# Altium schematic sheet User_Interface.SchDoc: User Interface
size A4; DocumentNumber: 14; SheetNumber: 14; SheetTotal: 51
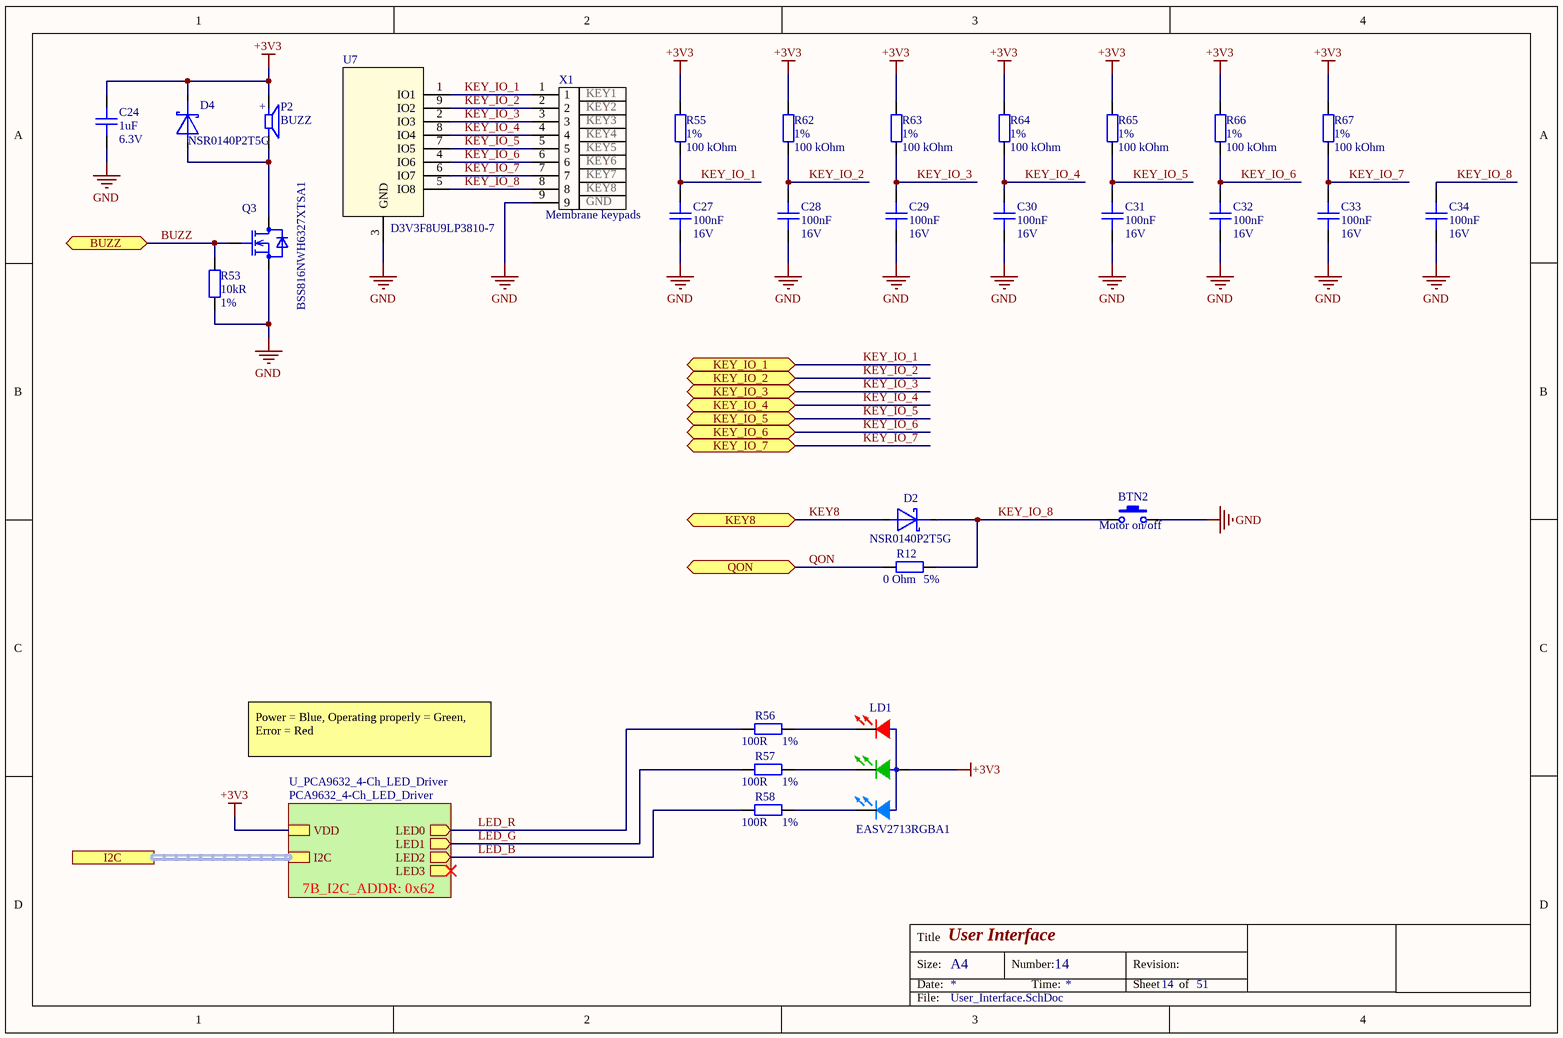
[diagram p0: User_Interface.SchDoc]

## Parts
BTN2  Motor on/off  [SWITCH KMS231GLFS]
C24  Capacitance: 1uF  Voltage Rating: 6.3V  [C0402]  (hidden comment: CAP CER 1UF 6.3V X5R 0402)
C27  Capacitance: 100nF  Voltage: 16V  [C0402]  (hidden comment: CAP CER 0.1UF 16V X7R 0402)
C28  Capacitance: 100nF  Voltage: 16V  [C0402]  (hidden comment: CAP CER 0.1UF 16V X7R 0402)
C29  Capacitance: 100nF  Voltage: 16V  [C0402]  (hidden comment: CAP CER 0.1UF 16V X7R 0402)
C30  Capacitance: 100nF  Voltage: 16V  [C0402]  (hidden comment: CAP CER 0.1UF 16V X7R 0402)
C31  Capacitance: 100nF  Voltage: 16V  [C0402]  (hidden comment: CAP CER 0.1UF 16V X7R 0402)
C32  Capacitance: 100nF  Voltage: 16V  [C0402]  (hidden comment: CAP CER 0.1UF 16V X7R 0402)
C33  Capacitance: 100nF  Voltage: 16V  [C0402]  (hidden comment: CAP CER 0.1UF 16V X7R 0402)
C34  Capacitance: 100nF  Voltage: 16V  [C0402]  (hidden comment: CAP CER 0.1UF 16V X7R 0402)
D2  NSR0140P2T5G  [SODFL100X40-2N]
D4  NSR0140P2T5G  [SODFL100X40-2N]
LD1  EASV2713RGBA1  [LED_EASV2713RGBA1]
P2  BUZZ  [SMT-0440-S-R_PUI]
Q3  BSS816NWH6327XTSA1  [SOT-323]
R12  Tolerance: 5%  Resistance: 0 Ohm  [R0402]  (hidden comment: RES SMD 0 OHM JUMPER 1/16W 0402)
R53  Resistance: 10kR  Tolerance: 1%  [R0402]  (hidden comment: RES SMD 10K OHM 1% 1/16W 0402)
R55  Tolerance: 1%  Resistance: 100 kOhm  [R0402]  (hidden comment: RES SMD 100K OHM 1% 1/16W 0402)
R56  Tolerance: 1%  Resistance: 100R  [R0402]  (hidden comment: RES SMD 100 OHM 1% 1/16W 0402)
R57  Tolerance: 1%  Resistance: 100R  [R0402]  (hidden comment: RES SMD 100 OHM 1% 1/16W 0402)
R58  Tolerance: 1%  Resistance: 100R  [R0402]  (hidden comment: RES SMD 100 OHM 1% 1/16W 0402)
R62  Tolerance: 1%  Resistance: 100 kOhm  [R0402]  (hidden comment: RES SMD 100K OHM 1% 1/16W 0402)
R63  Tolerance: 1%  Resistance: 100 kOhm  [R0402]  (hidden comment: RES SMD 100K OHM 1% 1/16W 0402)
R64  Tolerance: 1%  Resistance: 100 kOhm  [R0402]  (hidden comment: RES SMD 100K OHM 1% 1/16W 0402)
R65  Tolerance: 1%  Resistance: 100 kOhm  [R0402]  (hidden comment: RES SMD 100K OHM 1% 1/16W 0402)
R66  Tolerance: 1%  Resistance: 100 kOhm  [R0402]  (hidden comment: RES SMD 100K OHM 1% 1/16W 0402)
R67  Tolerance: 1%  Resistance: 100 kOhm  [R0402]  (hidden comment: RES SMD 100K OHM 1% 1/16W 0402)
U7  D3V3F8U9LP3810-7  [U-DFN3810-9]
X1  Membrane keypads  pin_1: KEY1  pin_2: KEY2  pin_3: KEY3  pin_4: KEY4  pin_5: KEY5  pin_6: KEY6  pin_7: KEY7  pin_8: KEY8  pin_9: GND  [CONN_0525590952]

## Sub-sheets
U_PCA9632_4-Ch_LED_Driver = PCA9632_4-Ch_LED_Driver: VDD, LED0 (out), LED1 (out), LED2 (out), LED3 (out), I2C (harness I2C)  | 7B_I2C_ADDR: 0x62

## Ports
BUZZ (bidir), I2C (harness I2C), KEY8 (bidir), KEY_IO_1 (bidir), KEY_IO_2 (bidir), KEY_IO_3 (bidir), KEY_IO_4 (bidir), KEY_IO_5 (bidir), KEY_IO_6 (bidir), KEY_IO_7 (bidir), QON (bidir)

## Nets
+3V3: C24.1 D4.1(K) LD1.1(A) P2.1 R55.2 R62.2 R63.2 R64.2 R65.2 R66.2 R67.2 ; sheet U_PCA9632_4-Ch_LED_Driver/VDD
GND: BTN2.2 C24.2 C27.2 C28.2 C29.2 C30.2 C31.2 C32.2 C33.2 C34.2 Q3.2(S) R53.2 U7.3(GND) X1.9
BUZZ: Q3.1(G) R53.1 ; port BUZZ
KEY8: D2.2(A) ; port KEY8
KEY_IO_1: C27.1 R55.1 U7.1(IO1) X1.1 ; port KEY_IO_1
KEY_IO_2: C28.1 R62.1 U7.9(IO2) X1.2 ; port KEY_IO_2
KEY_IO_3: C29.1 R63.1 U7.2(IO3) X1.3 ; port KEY_IO_3
KEY_IO_4: C30.1 R64.1 U7.8(IO4) X1.4 ; port KEY_IO_4
KEY_IO_5: C31.1 R65.1 U7.7(IO5) X1.5 ; port KEY_IO_5
KEY_IO_6: C32.1 R66.1 U7.4(IO6) X1.6 ; port KEY_IO_6
KEY_IO_7: C33.1 R67.1 U7.6(IO7) X1.7 ; port KEY_IO_7
KEY_IO_8: BTN2.1 C34.1 D2.1(K) R12.1 U7.5(IO8) X1.8
LED_B: R58.2 ; sheet U_PCA9632_4-Ch_LED_Driver/LED2
LED_G: R57.2 ; sheet U_PCA9632_4-Ch_LED_Driver/LED1
LED_R: R56.2 ; sheet U_PCA9632_4-Ch_LED_Driver/LED0
QON: R12.2 ; port QON
NetD4_2: D4.2(A) P2.2 Q3.3(D)
NetLD1_2: LD1.2(GK) R57.1
NetLD1_3: LD1.3(RK) R56.1
NetLD1_4: LD1.4(BK) R58.1

## Buses and harness runs
harness port I2C = sheet U_PCA9632_4-Ch_LED_Driver/I2C

## Notes on the sheet
- Power = Blue, Operating properly = Green,  Error = Red
- Title
- Size:
- Date:
- A4
- Number:
- Time:
- Revision:
- Sheet
- of
- File:
- (in symbol AUDIO MAGNETIC XDCR 2-4V SMD) +

## Library data of the parts
BTN2 = SWITCH TACTILE SPST-NO 0.05A 50V: Manufacturer: C&K; Manufacturer Part Number: KMS231GLFS; Mechanical Life: 100000Cycles; Throw Configuration: SPST; Actuator Type: Standard; Supplier 1: Digi-Key; Mount: Surface Mount; Min Operating Temperature: -40°C; Max Operating Temperature: 85°C; Packaging: Tape and Reel; Termination: SMD/SMT; ComponentLink1URL: https://www.digikey.com/en/products/detail/c-k/KMS231GLFS/499401; ComponentLink1Description: https://www.digikey.com/en/products/detail/c-k/KMS231GLFS/499401; Supplier Part Number 1: 401-1266-1-ND
C24 = CAP CER 1UF 6.3V X5R 0402: 1µF ±10% 6.3V Ceramic Capacitor X5R 0402 (1005 Metric); Manufacturer: Yageo; Manufacturer Part Number: CC0402KRX5R5BB105; Supplier 1: Digi-Key; Stock 1: 34926286; Pricing 1: 1=0.1, 10=0.05, 50=0.0272, 100=0.0222, 500=0.0158, 1000=0.0124, 2500=0.0113, 5000=0.0104 (USD); Mount: Surface Mount; Case/Package: 0402; Number of Pins: 2; Case Code (Metric): 1005; Case Code (Imperial): 0402; Min Operating Temperature: -55°C; Max Operating Temperature: 85°C; Packaging: Tape and Reel; Tolerance: 10%; Voltage Rating (DC): 6.3V; Dielectric: X5R; Termination: SMD/SMT; Package Quantity: 1; Composition: Ceramic; Length: 1mm; Height: 0.5mm; Width: 0.02inch; Thickness: 0.022inch; Depth: 0.5mm; Radiation Hardening: No; REACH SVHC: No SVHC; ComponentLink1URL: http://www.farnell.com/datasheets/70765.pdf?src-supplier=Farnell; ComponentLink1Description: http://www.farnell.com/datasheets/70765.pdf?src-supplier=Farnell; ComponentLink2URL: http://www.yageo.com/documents/recent/UPY-GPHC_X5R_4V-to-50V_25.pdf?src-supplier=Digi-Key; ComponentLink2Description: http://www.yageo.com/documents/recent/UPY-GPHC_X5R_4V-to-50V_25.pdf?src-supplier=Digi-Key; ComponentLink3URL: http://www.farnell.com/datasheets/2167237.pdf?src-supplier=Element14; ComponentLink3Description: http://www.farnell.com/datasheets/2167237.pdf?src-supplier=Element14; ComponentLink4URL: http://www.yageo.com/documents/recent/UPY-GPHC_X5R_4V-to-50V_12.pdf?src-supplier=Avnet+Europe; ComponentLink4Description: http://www.yageo.com/documents/recent/UPY-GPHC_X5R_4V-to-50V_12.pdf?src-supplier=Avnet+Europe; ComponentLink5URL: http://www.farnell.com/datasheets/1359354.pdf?src-supplier=Element14; ComponentLink5Description: http://www.farnell.com/datasheets/1359354.pdf?src-supplier=Element14; Supplier Part Number 1: 311-1438-1-ND; Dielectric Material: Ceramic; Lead Free: Lead Free; Halogen Free: Halogen Free; ComponentLink6URL: http://www.farnell.com/datasheets/70765.pdf?src-supplier=Element14; ComponentLink6Description: http://www.farnell.com/datasheets/70765.pdf?src-supplier=Element14; ComponentLink7URL: http://www.yageo.com/documents/recent/UPY-GPHC_X5R_4V-to-50V_12.pdf?src-supplier=Avnet; ComponentLink7Description: http://www.yageo.com/documents/recent/UPY-GPHC_X5R_4V-to-50V_12.pdf?src-supplier=Avnet
C27-C34 = CAP CER 0.1UF 16V X7R 0402: 0.1µF ±10% 16V Ceramic Capacitor X7R 0402 (1005 Metric); Manufacturer Part Number: CC0402KRX7R7BB104; Manufacturer: Yageo; Revision: July-2002: Re-released for DXP Platform.; Order: CC0402KRX7R7BB104; Supplier 1: Digi-Key; Stock 1: 25916830; Pricing 1: 1=0.1, 10=0.031, 100=0.0136, 500=0.0097, 1000=0.0077, 2500=0.007, 5000=0.0064 (USD); Mount: Surface Mount; Number of Pins: 2; Case Code (Metric): 1005; Case Code (Imperial): 0402; Min Operating Temperature: -55°C; Max Operating Temperature: 125°C; Tolerance: 10%; Dielectric: X7R; Voltage Rating: 16V; Voltage Rating (DC): 16V; Packaging: Tape and Reel; Package Quantity: 1; Termination: SMD/SMT; Composition: Ceramic; Length: 1mm; Height: 0.5mm; Width: 0.02inch; Thickness: 0.022inch; Depth: 0.5mm; Radiation Hardening: No; REACH SVHC: No SVHC; Lead Free: Lead Free; Halogen Free: Halogen Free; ComponentLink1URL: http://www.yageo.com/documents/recent/UPY-GPHC_X7R_6.3V-to-50V_8.pdf?src-supplier=Avnet+Europe; ComponentLink1Description: http://www.yageo.com/documents/recent/UPY-GPHC_X7R_6.3V-to-50V_8.pdf?src-supplier=Avnet+Europe; ComponentLink2URL: http://www.yageo.com/documents/recent/UPY-GPHC_X7R_6.3V-to-50V_18.pdf?src-supplier=Digi-Key; ComponentLink2Description: http://www.yageo.com/documents/recent/UPY-GPHC_X7R_6.3V-to-50V_18.pdf?src-supplier=Digi-Key; ComponentLink3URL: http://www.yageo.com/documents/recent/UPY-GPHC_X7R_6.3V-to-50V_8.pdf?src-supplier=Avnet; ComponentLink3Description: http://www.yageo.com/documents/recent/UPY-GPHC_X7R_6.3V-to-50V_8.pdf?src-supplier=Avnet; ComponentLink4URL: http://www.yageo.com/documents/recent/UPY-GPHC_X7R_6.3V-to-50V_18.pdf?src-supplier=Mouser; ComponentLink4Description: http://www.yageo.com/documents/recent/UPY-GPHC_X7R_6.3V-to-50V_18.pdf?src-supplier=Mouser; ComponentLink5URL: http://www.farnell.com/datasheets/2167236.pdf?src-supplier=Element14; ComponentLink5Description: http://www.farnell.com/datasheets/2167236.pdf?src-supplier=Element14; ComponentLink6URL: http://www.farnell.com/datasheets/1489800.pdf?src-supplier=Element14; ComponentLink6Description: http://www.farnell.com/datasheets/1489800.pdf?src-supplier=Element14; Supplier Part Number 1: 311-1338-1-ND
D2 = DIODE SCHOTTKY 30V 70MA SOD923: Diode Schottky 30V 70mA (DC) Surface Mount SOD-923; Manufacturer: ON Semiconductor; Forward Voltage: 350mV; Max Surge Current: 500mA; Max Power Dissipation: 100mW; Max Reverse Leakage Current: 500nA; Element Configuration: Single; Supplier 1: Digi-Key; Manufacturer Part Number: NSR0140P2T5G; Stock 1: 28802; Pricing 1: 1=0.36, 10=0.27, 25=0.2368, 100=0.1284, 500=0.1048, 1000=0.0777, 2500=0.0683 (USD); Case/Package: SOD-923-2; Number of Pins: 2; Contact Plating: Tin,Matte; Min Operating Temperature: -55°C; Max Operating Temperature: 125°C; Forward Current: 70mA; Package Quantity: 1; Packaging: Tape and Reel; Average Rectified Current: 70mA; Max Repetitive Reverse Voltage (Vrrm): 30V; Peak Reverse Current: 500nA; Power Dissipation: 100mW; Peak Non-Repetitive Surge Current: 500mA; Max Forward Surge Current (Ifsm): 500mA; Termination: SMD/SMT; Max Reverse Voltage (DC): 30V; Length: 0.85mm; Height: 0.43mm; Width: 0.65mm; Radiation Hardening: No; REACH SVHC: No SVHC; Lead Free: Lead Free; ComponentLink1URL: http://www.onsemi.com/pub_link/Collateral/NSR0140P2-D.PDF?src-supplier=Future+Electronics; ComponentLink1Description: http://www.onsemi.com/pub_link/Collateral/NSR0140P2-D.PDF?src-supplier=Future+Electronics; ComponentLink2URL: http://www.farnell.com/datasheets/2353885.pdf?src-supplier=Newark; ComponentLink2Description: http://www.farnell.com/datasheets/2353885.pdf?src-supplier=Newark; ComponentLink3URL: http://www.farnell.com/datasheets/86281.pdf?src-supplier=Element14; ComponentLink3Description: http://www.farnell.com/datasheets/86281.pdf?src-supplier=Element14; ComponentLink4URL: http://www.onsemi.com/pub/Collateral/NSR0140P2-D.PDF?src-supplier=Avnet; ComponentLink4Description: http://www.onsemi.com/pub/Collateral/NSR0140P2-D.PDF?src-supplier=Avnet; ComponentLink5URL: http://www.onsemi.com/pub/Collateral/NSR0140P2-D.PDF?src-supplier=Digi-Key; ComponentLink5Description: http://www.onsemi.com/pub/Collateral/NSR0140P2-D.PDF?src-supplier=Digi-Key; ComponentLink6URL: http://www.mouser.com/ds/2/308/NSR0140P2-D-115172.pdf?src-supplier=Mouser; ComponentLink6Description: http://www.mouser.com/ds/2/308/NSR0140P2-D-115172.pdf?src-supplier=Mouser; Supplier Part Number 1: NSR0140P2T5GOSCT-ND; Mount: Surface Mount
D4 = DIODE SCHOTTKY 30V 70MA SOD923: Diode Schottky 30V 70mA (DC) Surface Mount SOD-923; Manufacturer: ON Semiconductor; Forward Voltage: 350mV; Max Surge Current: 500mA; Peak Reverse Current: 500nA; Element Configuration: Single; Max Power Dissipation: 100mW; Supplier 1: Digi-Key; Manufacturer Part Number: NSR0140P2T5G; Stock 1: 28802; Pricing 1: 1=0.36, 10=0.27, 25=0.2368, 100=0.1284, 500=0.1048, 1000=0.0777, 2500=0.0683 (USD); Min Operating Temperature: -55°C; Max Operating Temperature: 125°C; Packaging: Tape and Reel; Radiation Hardening: No; Lead Free: Lead Free; ComponentLink1URL: http://www.onsemi.com/pub_link/Collateral/NSR0140P2-D.PDF?src-supplier=Future+Electronics; ComponentLink1Description: http://www.onsemi.com/pub_link/Collateral/NSR0140P2-D.PDF?src-supplier=Future+Electronics; ComponentLink2URL: http://www.farnell.com/datasheets/2353885.pdf?src-supplier=Newark; ComponentLink2Description: http://www.farnell.com/datasheets/2353885.pdf?src-supplier=Newark; ComponentLink3URL: http://www.farnell.com/datasheets/86281.pdf?src-supplier=Element14; ComponentLink3Description: http://www.farnell.com/datasheets/86281.pdf?src-supplier=Element14; Supplier Part Number 1: NSR0140P2T5GOSCT-ND; Number of Pins: 2; Forward Current: 70mA; Package Quantity: 1; Average Rectified Current: 70mA; Max Repetitive Reverse Voltage (Vrrm): 30V; Peak Non-Repetitive Surge Current: 500mA; Max Reverse Voltage (DC): 30V; Max Reverse Leakage Current: 500nA; Case/Package: SOD-923-2; Contact Plating: Tin,Matte; Power Dissipation: 100mW; Max Forward Surge Current (Ifsm): 500mA; Termination: SMD/SMT; Length: 0.85mm; Height: 0.43mm; Width: 0.65mm; REACH SVHC: No SVHC; ComponentLink4URL: http://www.onsemi.com/pub/Collateral/NSR0140P2-D.PDF?src-supplier=Avnet; ComponentLink4Description: http://www.onsemi.com/pub/Collateral/NSR0140P2-D.PDF?src-supplier=Avnet; ComponentLink5URL: http://www.onsemi.com/pub/Collateral/NSR0140P2-D.PDF?src-supplier=Digi-Key; ComponentLink5Description: http://www.onsemi.com/pub/Collateral/NSR0140P2-D.PDF?src-supplier=Digi-Key; ComponentLink6URL: http://www.mouser.com/ds/2/308/NSR0140P2-D-115172.pdf?src-supplier=Mouser; ComponentLink6Description: http://www.mouser.com/ds/2/308/NSR0140P2-D-115172.pdf?src-supplier=Mouser; Mount: Surface Mount
LD1 = LED RGB PCB SIDE VIEW SMD: Red, Green, Blue (RGB) 619nm Red, 532nm Green, 473nm Blue LED Indication - Discrete 1.85V Red, 2.9V Green, 2.9V Blue 4-SMD, No Lead; Manufacturer: Everlight Electronics Co Ltd; Color: Blue,Green,Red; Lens Style: Rectangle with Flat Top; Element Configuration: Common Anode; Lens Transparency: Diffused; Forward Voltage: 3.3V; Test Current: 5mA; Viewing Angle: 130°; Supplier 1: Digi-Key; Manufacturer Part Number: EASV2713RGBA1; Stock 1: 7810; Pricing 1: 1=0.51, 50=0.415, 100=0.298, 500=0.272 (USD); Mount: Surface Mount; Packaging: Tape and Reel; Height: 0.5mm; ComponentLink1URL: https://www.digikey.com/en/products/detail/everlight-electronics-co-ltd/EASV2713RGBA1/11200807; ComponentLink1Description: https://www.digikey.com/en/products/detail/everlight-electronics-co-ltd/EASV2713RGBA1/11200807; Supplier Part Number 1: 1080-EASV2713RGBA1TR-ND
P2 = AUDIO MAGNETIC XDCR 2-4V SMD: Buzzers Transducer, Externally Driven 90mA 4kHz 70dB @ 3V, 10cm Surface Mount Solder Pads; Manufacturer: Projects Unlimited; Manufacturer Part Number: SMT-0440-S-R; Supplier 1: Digi-Key; Stock 1: 4568; Pricing 1: 1=3.25, 10=2.689, 25=2.4812, 50=2.3302, 100=2.185, 500=1.885 (USD); Mount: Surface Mount; Min Operating Temperature: -20°C; Max Operating Temperature: 70°C; Termination: Solder; Frequency: 4kHz; Packaging: Tape and Reel; Voltage Rating: 3V; ComponentLink1URL: http://www.puiaudio.com/pdf/SMT-0440-S-R.pdf?src-supplier=Avnet; ComponentLink1Description: http://www.puiaudio.com/pdf/SMT-0440-S-R.pdf?src-supplier=Avnet; ComponentLink2URL: http://www.mouser.com/ds/2/334/SMT-0440-S-R-535654.pdf?src-supplier=Mouser; ComponentLink2Description: http://www.mouser.com/ds/2/334/SMT-0440-S-R-535654.pdf?src-supplier=Mouser; ComponentLink3URL: http://www.puiaudio.com/pdf/SMT-0440-S-R.pdf?src-supplier=Digi-Key; ComponentLink3Description: http://www.puiaudio.com/pdf/SMT-0440-S-R.pdf?src-supplier=Digi-Key; Supplier Part Number 1: 668-1488-1-ND; Operating Supply Current: 90mA; Sensing Method: Magnetic; Length: 4mm; Width: 4mm
Q3 = MOSFET BSS816NWH6327XTSA1 N-CH 20V 1.4A SOT323: N-Channel 20V 1.4A (Ta) 500mW (Ta) Surface Mount PG-SOT323-3; Manufacturer: Infineon; Rds On Max: 160mR; Rise Time: 9ns; Input Capacitance: 180pF; Turn-On Delay Time: 5.3ns; Turn-Off Delay Time: 11ns; Fall Time: 2.2ns; Threshold Voltage: 550mV; Gate to Source Voltage (Vgs): 8V; Number of Channels: 1; Supplier 1: Digi-Key; Manufacturer Part Number: BSS816NWH6327XTSA1; Stock 1: 12407; Pricing 1: 1=0.37, 10=0.306, 25=0.2564, 100=0.1254, 250=0.1234, 500=0.1046, 1000=0.0727 (USD); Mount: Surface Mount; Case/Package: SOT-323; Number of Pins: 3; Weight: 0.004395oz; Contact Plating: Tin; Min Operating Temperature: -55°C; Max Operating Temperature: 150°C; Packaging: Tape and Reel; Drain to Source Voltage (Vdss): 20V; Max Dual Supply Voltage: 20V; Continuous Drain Current (ID): 1.4A; Max Power Dissipation: 500mW; Drain to Source Breakdown Voltage: 20V; Drain to Source Resistance: 160mR; Package Quantity: 3000; Halogen Free: Halogen Free; REACH SVHC: No SVHC; Lead Free: Lead Free; ComponentLink1URL: http://www.infineon.com/dgdl/BSS816NW_Rev2.3_.pdf?folderId=db3a3043156fd573011622e10b5c1f67&fileId=db3a304335113a6301351e704a2e1332&src-supplier=Avnet; ComponentLink1Description: http://www.infineon.com/dgdl/BSS816NW_Rev2.3_.pdf?folderId=db3a3043156fd573011622e10b5c1f67&fileId=db3a304335113a6301351e704a2e1332&src-supplier=Avnet; ComponentLink2URL: http://www.farnell.com/datasheets/2117725.pdf?src-supplier=Farnell; ComponentLink2Description: http://www.farnell.com/datasheets/2117725.pdf?src-supplier=Farnell; ComponentLink3URL: https://www.infineon.com/dgdl/Infineon-BSS816NW-DS-v02_03-en.pdf?fileId=db3a304335113a6301351e704a2e1332&src-supplier=Digi-Key; ComponentLink3Description: https://www.infineon.com/dgdl/Infineon-BSS816NW-DS-v02_03-en.pdf?fileId=db3a304335113a6301351e704a2e1332&src-supplier=Digi-Key; ComponentLink4URL: http://components.arrow.com/part/dataview/53682469S9650N2051?src-supplier=Arrow; ComponentLink4Description: http://components.arrow.com/part/dataview/53682469S9650N2051?src-supplier=Arrow; ComponentLink5URL: http://www.farnell.com/datasheets/2117725.pdf?src-supplier=Element14; ComponentLink5Description: http://www.farnell.com/datasheets/2117725.pdf?src-supplier=Element14; ComponentLink6URL: http://www.mouser.com/ds/2/196/Infineon-BSS816NW-DS-v02_03-en-522793.pdf?src-supplier=Mouser; ComponentLink6Description: http://www.mouser.com/ds/2/196/Infineon-BSS816NW-DS-v02_03-en-522793.pdf?src-supplier=Mouser; Supplier Part Number 1: BSS816NWH6327XTSA1CT-ND
R12 = RES SMD 0 OHM JUMPER 1/16W 0402: 0 Ohms Jumper 0.063W, 1/16W Chip Resistor 0402 (1005 Metric) Moisture Resistant Thick Film; Manufacturer: Yageo; Manufacturer Part Number: RC0402JR-070RL; Power Rating: 62.5mW; Voltage Rating: 50V; Max Power Dissipation: 63mW; Temperature Coefficient: 200ppm/°C; Supplier 1: Digi-Key; Stock 1: 46057148; Pricing 1: 1=0.1, 10=0.013, 25=0.0092, 50=0.0072, 100=0.0053, 250=0.004, 500=0.0032, 1000=0.0024, 5000=0.0017 (USD); Contact Plating: Tin,Matte; Case Code (Metric): 1005; Case Code (Imperial): 0402; Min Operating Temperature: -55°C; Max Operating Temperature: 155°C; Packaging: Tape and Reel; Composition: Thick Film; Package Quantity: 1; Number of Terminations: 2; Termination: SMD/SMT; Military Standard: Not; Features: Moisture Resistant; Length: 1mm; Height: 0.016inch; Width: 0.02inch; Depth: 0.5mm; Radiation Hardening: No; REACH SVHC: Unknown; Lead Free: Lead Free; ComponentLink1URL: http://www.yageo.com/documents/recent/PYu-RC_Group_51_RoHS_L_10.pdf?src-supplier=Digi-Key; ComponentLink1Description: http://www.yageo.com/documents/recent/PYu-RC_Group_51_RoHS_L_10.pdf?src-supplier=Digi-Key; ComponentLink2URL: http://www.yageo.com/documents/recent/PYu-RC0402_51_RoHS_L_6.pdf?src-supplier=Avnet+Europe; ComponentLink2Description: http://www.yageo.com/documents/recent/PYu-RC0402_51_RoHS_L_6.pdf?src-supplier=Avnet+Europe; ComponentLink3URL: http://www.farnell.com/datasheets/1018594.pdf?src-supplier=Element14; ComponentLink3Description: http://www.farnell.com/datasheets/1018594.pdf?src-supplier=Element14; ComponentLink4URL: https://www.verical.com/server-webapp/html/getDatasheet?partID=326379&src-supplier=Verical; ComponentLink4Description: https://www.verical.com/server-webapp/html/getDatasheet?partID=326379&src-supplier=Verical; ComponentLink5URL: http://www.farnell.com/datasheets/2167052.pdf?src-supplier=Element14; ComponentLink5Description: http://www.farnell.com/datasheets/2167052.pdf?src-supplier=Element14; Supplier Part Number 1: 311-0.0JRCT-ND; Case/Package: 0402; Mount: Surface Mount; ClassName: +3V3_PS
R53 = RES SMD 10K OHM 1% 1/16W 0402: 10 kOhms ±1% 0.063W, 1/16W Chip Resistor 0402 (1005 Metric) Moisture Resistant Thick Film; Manufacturer Part Number: RC0402FR-0710KP; Manufacturer: Yageo; Temperature Coefficient: 150ppm/°C; Max Power Dissipation: 63mW; Supplier 1: Digi-Key; Stock 1: 839368; Pricing 1: 1=0.1, 10=0.035, 100=0.014, 1000=0.0063, 2500=0.0055, 5000=0.0045 (USD); Case Code (Imperial): 0402; Case Code (Metric): 1005; Min Operating Temperature: -55°C; Max Operating Temperature: 155°C; Composition: Thick Film; Packaging: Tape and Reel; Number of Terminations: 2; Length: 0.039inch; Height: 0.016inch; Width: 0.02inch; ComponentLink1URL: http://www.yageo.com/NewPortal/yageodocoutput?fileName=/pdf/R-Chip/PYu-RC_51_RoHS_P_0.pdf&src-supplier=Digi-Key; ComponentLink1Description: http://www.yageo.com/NewPortal/yageodocoutput?fileName=/pdf/R-Chip/PYu-RC_51_RoHS_P_0.pdf&src-supplier=Digi-Key; Supplier Part Number 1: YAG1249CT-ND; Case/Package: 0402; Features: Moisture Resistant; Mount: Surface Mount
R55 R62-R67 = RES SMD 100K OHM 1% 1/16W 0402: 100 kOhms ±1% 0.063W, 1/16W Chip Resistor 0402 (1005 Metric) Moisture Resistant Thick Film; Manufacturer: Yageo; Manufacturer Part Number: RC0402FR-07100KL; Temperature Coefficient: 100ppm/°C; Power Rating: 63mW; Voltage Rating: 50V; Supplier 1: Digi-Key; Stock 1: 47448883; Pricing 1: 1=0.1, 10=0.016, 100=0.0064, 1000=0.0029, 2500=0.0025, 5000=0.0021 (USD); Case Code (Metric): 1005; Case Code (Imperial): 0402; Min Operating Temperature: -55°C; Max Operating Temperature: 155°C; Composition: Thick Film; Packaging: Tape and Reel; Package Quantity: 1; Number of Terminations: 2; Termination: SMD/SMT; Military Standard: Not; Max Power Dissipation: 63mW; Working Voltage: 50V; Features: Moisture Resistant; Length: 0.039inch; Height: 0.016inch; Width: 0.02inch; Depth: 0.5mm; REACH SVHC: No SVHC; Lead Free: Lead Free; ComponentLink1URL: http://www.yageo.com/documents/recent/PYu-RC_Group_51_RoHS_L_10.pdf?src-supplier=Digi-Key; ComponentLink1Description: http://www.yageo.com/documents/recent/PYu-RC_Group_51_RoHS_L_10.pdf?src-supplier=Digi-Key; ComponentLink2URL: http://www.farnell.com/datasheets/1018594.pdf?src-supplier=Element14; ComponentLink2Description: http://www.farnell.com/datasheets/1018594.pdf?src-supplier=Element14; ComponentLink3URL: http://www.yageo.com/documents/recent/PYu-RC_Group_51_RoHS_L_9.pdf?src-supplier=Verical; ComponentLink3Description: http://www.yageo.com/documents/recent/PYu-RC_Group_51_RoHS_L_9.pdf?src-supplier=Verical; ComponentLink4URL: http://www.yageo.com/documents/recent/PYu-RC_Group_51_RoHS_L_9.pdf?src-supplier=Mouser; ComponentLink4Description: http://www.yageo.com/documents/recent/PYu-RC_Group_51_RoHS_L_9.pdf?src-supplier=Mouser; ComponentLink5URL: http://documents.rs-components.com/techlib://itc_doclist_GB.htm?stockno=6185797&src-supplier=RSComponents; ComponentLink5Description: http://documents.rs-components.com/techlib://itc_doclist_GB.htm?stockno=6185797&src-supplier=RSComponents; Supplier Part Number 1: 311-100KLRDKR-ND; Case/Package: 0402; ClassName: TCPP; Mount: Surface Mount
R56-R58 = RES SMD 100 OHM 1% 1/16W 0402: 100 Ohms ±1% 0.063W, 1/16W Chip Resistor 0402 (1005 Metric) Moisture Resistant Thick Film; Manufacturer: Yageo; Manufacturer Part Number: RC0402FR-07100RL; Power Rating: 62.5mW; Voltage Rating: 50V; Temperature Coefficient: 100ppm/°C; Supplier 1: Digi-Key; Stock 1: 16989760; Pricing 1: 1=0.1, 10=0.016, 100=0.0064, 1000=0.0029, 2500=0.0025, 5000=0.0021 (USD); Case/Package: 0402; Number of Pins: 2; Case Code (Imperial): 0402; Case Code (Metric): 1005; Min Operating Temperature: -55°C; Max Operating Temperature: 155°C; Voltage Rating (DC): 50V; Packaging: Tape and Reel; Termination: SMD/SMT; Composition: Thick Film; Military Standard: Not; Length: 1mm; Height: 0.32mm; Width: 0.5mm; Depth: 0.5mm; REACH SVHC: No SVHC; Lead Free: Lead Free; ComponentLink1URL: http://www.farnell.com/datasheets/2167052.pdf?src-supplier=Element14; ComponentLink1Description: http://www.farnell.com/datasheets/2167052.pdf?src-supplier=Element14; ComponentLink2URL: http://www.yageo.com/documents/recent/PYu-RC_Group_51_RoHS_L_9.pdf?src-supplier=Mouser; ComponentLink2Description: http://www.yageo.com/documents/recent/PYu-RC_Group_51_RoHS_L_9.pdf?src-supplier=Mouser; ComponentLink3URL: http://www.yageo.com/documents/recent/PYu-RC0402_51_RoHS_L_6_r.pdf?src-supplier=Future+Electronics; ComponentLink3Description: http://www.yageo.com/documents/recent/PYu-RC0402_51_RoHS_L_6_r.pdf?src-supplier=Future+Electronics; ComponentLink4URL: https://www.verical.com/server-webapp/html/getDatasheet?partID=329466&src-supplier=Verical; ComponentLink4Description: https://www.verical.com/server-webapp/html/getDatasheet?partID=329466&src-supplier=Verical; ComponentLink5URL: http://www.farnell.com/datasheets/1018594.pdf?src-supplier=Element14; ComponentLink5Description: http://www.farnell.com/datasheets/1018594.pdf?src-supplier=Element14; ComponentLink6URL: http://documents.rs-components.com/techlib://itc_doclist_GB.htm?stockno=6185810&src-supplier=RSComponents; ComponentLink6Description: http://documents.rs-components.com/techlib://itc_doclist_GB.htm?stockno=6185810&src-supplier=RSComponents; Supplier Part Number 1: 311-100LRDKR-ND
U7 = TVS DIODE PP U-DFN3810-9: 5V (Typ) Clamp 5A (8/20µs) Ipp Tvs Diode Surface Mount U-DFN3810-9; Manufacturer: Diodes; Supplier 1: Digi-Key; Manufacturer Part Number: D3V3F8U9LP3810-7; Stock 1: 14880; Pricing 1: 1=0.42, 10=0.317, 100=0.1508, 500=0.1336, 1000=0.104 (USD); Supplier Part Number 1: D3V3F8U9LP3810-7DICT-ND
X1 = CONN FFC VERT 9POS 0.50MM SMD: 9 Position FFC, FPC Connector Contacts, Vertical - 1 Sided 0.020" (0.50mm) Surface Mount; Manufacturer: Molex; Manufacturer Part Number: 0525590952; Current Rating: 500mA; Voltage Rating: 50V; Number of Positions: 12; Pitch: 0.5mm; Supplier 1: Digi-Key; Stock 1: 4369; Pricing 1: 1=2.66, 10=2.267, 100=1.8728 (USD); Mount: Surface Mount; Contact Plating: Gold; Contact Material: Gold; Housing Material: Nylon; Number of Rows: 1; Package Quantity: 1000; Packaging: Tape and Reel; Termination: SMD/SMT; Number of Contacts: 12; Series: 052745; Number of Circuits: 12; REACH SVHC: Unknown; ComponentLink1URL: https://www.digikey.com/en/products/detail/molex/0525590952/3262913?s=N4IgTCBcDaIKxjnAnABmQkBdAvkA; ComponentLink1Description: https://www.digikey.com/en/products/detail/molex/0525590952/3262913?s=N4IgTCBcDaIKxjnAnABmQkBdAvkA; Supplier Part Number 1: WM10983TR-ND